# EAGLE schematic schéma eagle (EAGLE 9.6.2)
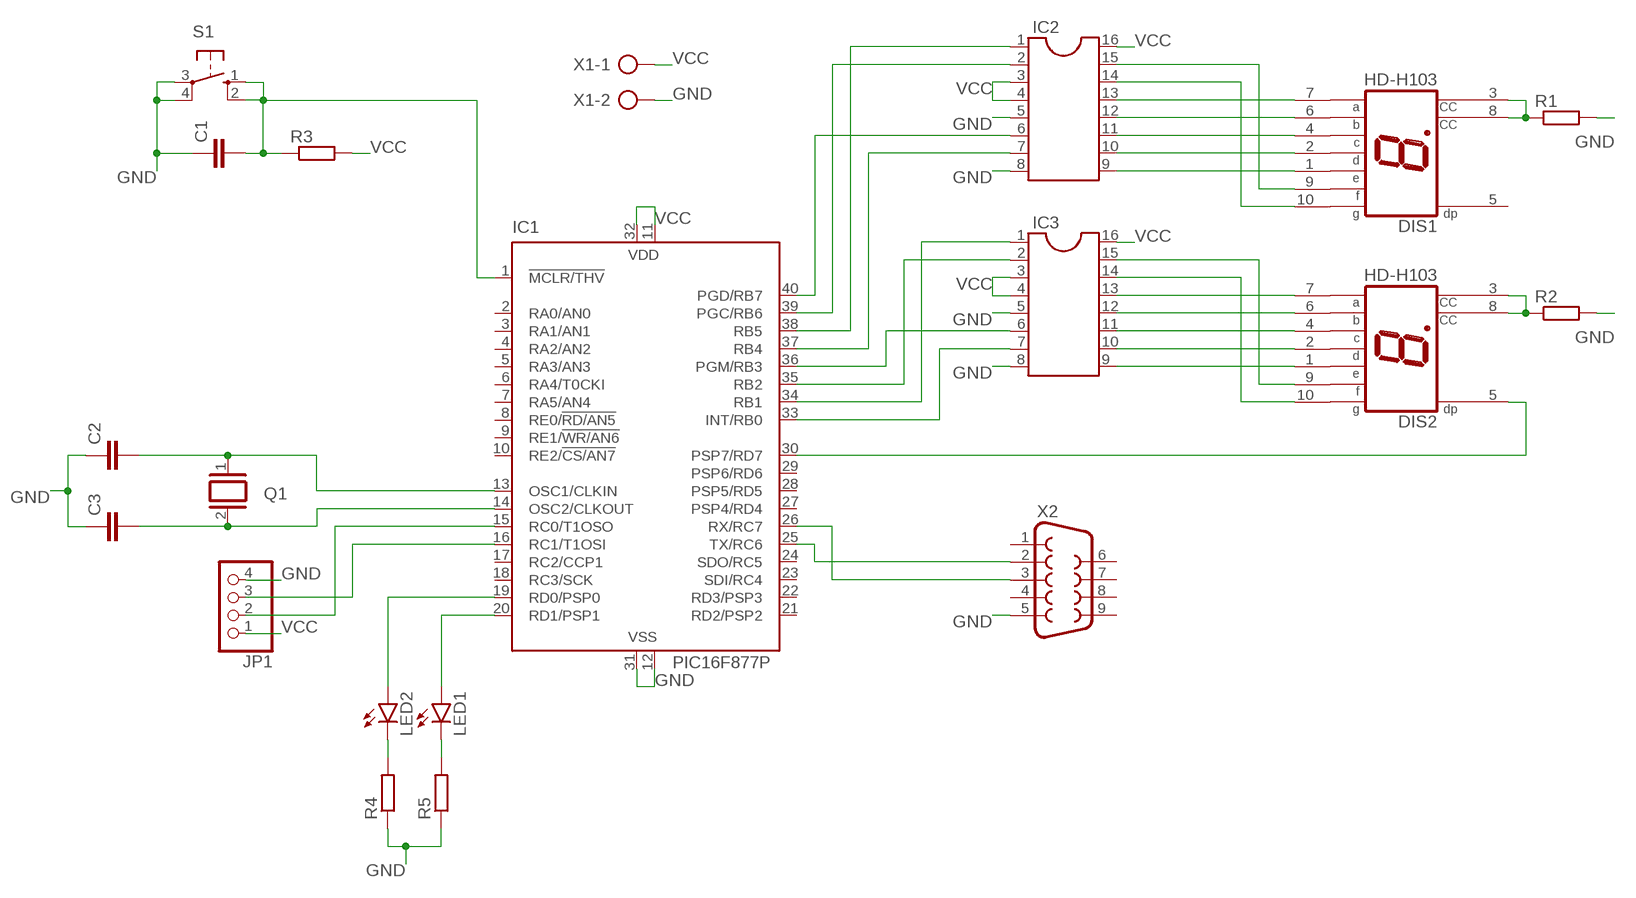
[diagram p0: schematic, sheet 1]

## Parts
C1  C-EU025-025X050  [C025-025X050]
C2  C-EU025-025X050  [C025-025X050]
C3  C-EU025-025X050  [C025-025X050]
DIS1  HD-H103  [HDSP-M]
DIS2  HD-H103  [HDSP-M]
IC1  PIC16F877P  [DIL40]
IC2  DIL16  [DIL16]
IC3  DIL16  [DIL16]
JP1  PINHD-1X4  [1X04]
LED1  LED5MM  [LED5MM]
LED2  LED5MM  [LED5MM]
Q1  XTAL/S  [QS]
R1  R-EU_0207/10  [0207/10]
R2  R-EU_0207/10  [0207/10]
R3  R-EU_0207/10  [0207/10]
R4  R-EU_0207/10  [0207/10]
R5  R-EU_0207/10  [0207/10]
S1  10-XX  [B3F-10XX]
X1  AK300/2  [AK300/2]
X2  F09H  [F09H]

## Nets
GND: C1.1 C2.1 C3.1 IC1.12(VSS) IC1.31(VSS) IC2.5 IC2.8 IC3.5 IC3.8 JP1.4 R1.2 R2.2 R4.1 R5.1 S1.3(P) S1.4(P1) X1.2 X2.5
N$1: IC1.25(TX/RC6) X2.2
N$2: IC1.26(RX/RC7) X2.3
N$3: IC1.33(INT/RB0) IC3.7
N$4: IC1.34(RB1) IC3.1
N$5: IC1.35(RB2) IC3.2
N$6: IC1.36(PGM/RB3) IC3.6
N$7: IC1.37(RB4) IC2.7
N$8: IC1.38(RB5) IC2.1
N$9: IC1.39(PGC/RB6) IC2.2
N$10: IC1.40(PGD/RB7) IC2.6
N$11: DIS1.7(A) IC2.13
N$12: DIS1.6(B) IC2.12
N$13: DIS1.4(C) IC2.11
N$14: DIS1.2(D) IC2.10
N$15: DIS1.1(E) IC2.9
N$16: DIS1.9(F) IC2.15
N$17: DIS1.10(G) IC2.14
N$18: DIS2.7(A) IC3.13
N$19: DIS2.6(B) IC3.12
N$20: DIS2.4(C) IC3.11
N$21: DIS2.2(D) IC3.10
N$22: DIS2.1(E) IC3.9
N$23: DIS2.9(F) IC3.15
N$24: DIS2.10(G) IC3.14
N$25: DIS1.3(CC) DIS1.8(CC) R1.1
N$26: DIS2.3(CC) DIS2.8(CC) R2.1
N$27: DIS2.5(DP) IC1.30(PSP7/RD7)
N$28: C1.2 IC1.1(!MCLR/THV) R3.1 S1.1(S) S1.2(S1)
N$29: C2.2 IC1.13(OSC1/CLKIN) Q1.1
N$30: C3.2 IC1.14(OSC2/CLKOUT) Q1.2
N$31: IC1.15(RC0/T1OSO) JP1.2
N$32: IC1.16(RC1/T1OSI) JP1.3
N$35: IC1.19(RD0/PSP0) LED2.A
N$36: IC1.20(RD1/PSP1) LED1.A
N$37: LED2.K(C) R4.2
N$38: LED1.K(C) R5.2
VCC: IC1.11(VDD) IC1.32(VDD) IC2.3 IC2.4 IC2.16 IC3.3 IC3.4 IC3.16 JP1.1 R3.2 X1.1
Unconnected: DIS1.5(DP) IC1.2(RA0/AN0) IC1.3(RA1/AN1) IC1.4(RA2/AN2) IC1.5(RA3/AN3) IC1.6(RA4/T0CKI) IC1.7(RA5/AN4) IC1.8(RE0/!RD/AN5) IC1.9(RE1/!WR/AN6) IC1.10(RE2/!CS/AN7) IC1.17(RC2/CCP1) IC1.18(RC3/SCK) IC1.21(RD2/PSP2) IC1.22(RD3/PSP3) IC1.23(SDI/RC4) IC1.24(SDO/RC5) IC1.27(PSP4/RD4) IC1.28(PSP5/RD5) IC1.29(PSP6/RD6) X2.1 X2.4 X2.6 X2.7 X2.8 X2.9

## Library data of the parts
C1-C3 = rcl:C-EU: CAPACITOR, European symbol; SPICEPREFIX: C
DIS1 DIS2 = display-hp:HD-H103: LED DISPLAY 1-character 7 segment, decimal point right; OC_FARNELL: unknown; OC_NEWARK: unknown
IC1 = microchip:PIC16F87*: MICROCONTROLLER; MF: MICROCHIP; MPN: PIC16F877-04/P; OC_FARNELL: 9761349; OC_NEWARK: 61K3463
IC2 IC3 = ic-package:DIL16: Dual In Line / Socket
JP1 = pinhead:PINHD-1X4: PIN HEADER
LED1 LED2 = led:LED: LED OSRAM: - CHIPLED LG R971, LG N971, LY N971, LG Q971, LY Q971, LO R971, LY R971 LH N974, LH R974 LS Q976, LO Q976, LY Q976 LO Q996 - Hyper CHIPLED LW Q18S LB Q993, LB Q99A, LB R99A - SideLED LS A670, LO A670, LY A670, LG A670, LP A670 LB A673, LV A673, LT A673, LW A673 LH A674 LY A675 LS A676, LA A676, LO A676, LY A676, LW A676 LS A679, LY A679, LG A679 - Hyper Micro SIDELED® LS Y876, LA Y876, LO Y876, LY Y876 LT Y87S - SmartLED LW L88C, LW L88S LB L89C, LB L89S, LG L890 LS L89K, LO L89K, LY L89K LS L896, LA L896, LO L896, LY L896 - TOPLED LS T670, LO T670, LY T670, LG T670, LP T670 LSG T670, LSP T670, LSY T670, LOP T670, LYG T670 LG T671, LOG T671, LSG T671 LB T673, LV T673, LT T673, LW T673 LH T674 LS T676, LA T676, LO T676, LY T676, LB T676, LH T676, LSB T676, LW T676 LB T67C, LV T67C, LT T67C, LS T67K, LO T67K, LY T67K, LW E67C LS E67B, LA E67B, LO E67B, LY E67B, LB E67C, LV E67C, LT E67C LW T67C LS T679, LY T679, LG T679 LS T770, LO T770, LY T770, LG T770, LP T770 LB T773, LV T773, LT T773, LW T773 LH T774 LS E675, LA E675, LY E675, LS T675 LS T776, LA T776, LO T776, LY T776, LB T776 LHGB T686 LT T68C, LB T68C - Hyper Mini TOPLED® LB M676 - Mini TOPLED Santana® LG M470 LS M47K, LO M47K, LY M47K Source: http://www.osram.convergy.de LUXEON: - LUMILED® LXK2-PW12-R00, LXK2-PW12-S00, LXK2-PW14-U00, LXK2-PW14-V00 LXK2-PM12-R00, LXK2-PM12-S00, LXK2-PM14-U00 LXK2-PE12-Q00, LXK2-PE12-R00, LXK2-PE12-S00, LXK2-PE14-T00, LXK2-PE14-U00 LXK2-PB12-K00, LXK2-PB12-L00, LXK2-PB12-M00, LXK2-PB14-N00, LXK2-PB14-P00, LXK2-PB14-Q00 LXK2-PR12-L00, LXK2-PR12-M00, LXK2-PR14-Q00, LXK2-PR14-R00 LXK2-PD12-Q00, LXK2-PD12-R00, LXK2-PD12-S00 LXK2-PH12-R00, LXK2-PH12-S00 LXK2-PL12-P00, LXK2-PL12-Q00, LXK2-PL12-R00 Source: www.luxeon.com KINGBRIGHT: KA-3528ASYC Source: www.kingbright.com
Q1 = special:XTAL/S: CRYSTAL
R1-R5 = rcl:R-EU_: RESISTOR, European symbol; SPICEPREFIX: R
S1 = switch-omron:10-XX: OMRON SWITCH; MPN: B3F-1000; OC_FARNELL: 176432; OC_NEWARK: 36M3542
X1 = con-ptr500:AK300/2: CONNECTOR; OC_FARNELL: unknown; OC_NEWARK: unknown
X2 = con-subd:F09: SUB-D; OC_FARNELL: unknown; OC_NEWARK: unknown